# EAGLE design M688B (EAGLE 6.6.0)
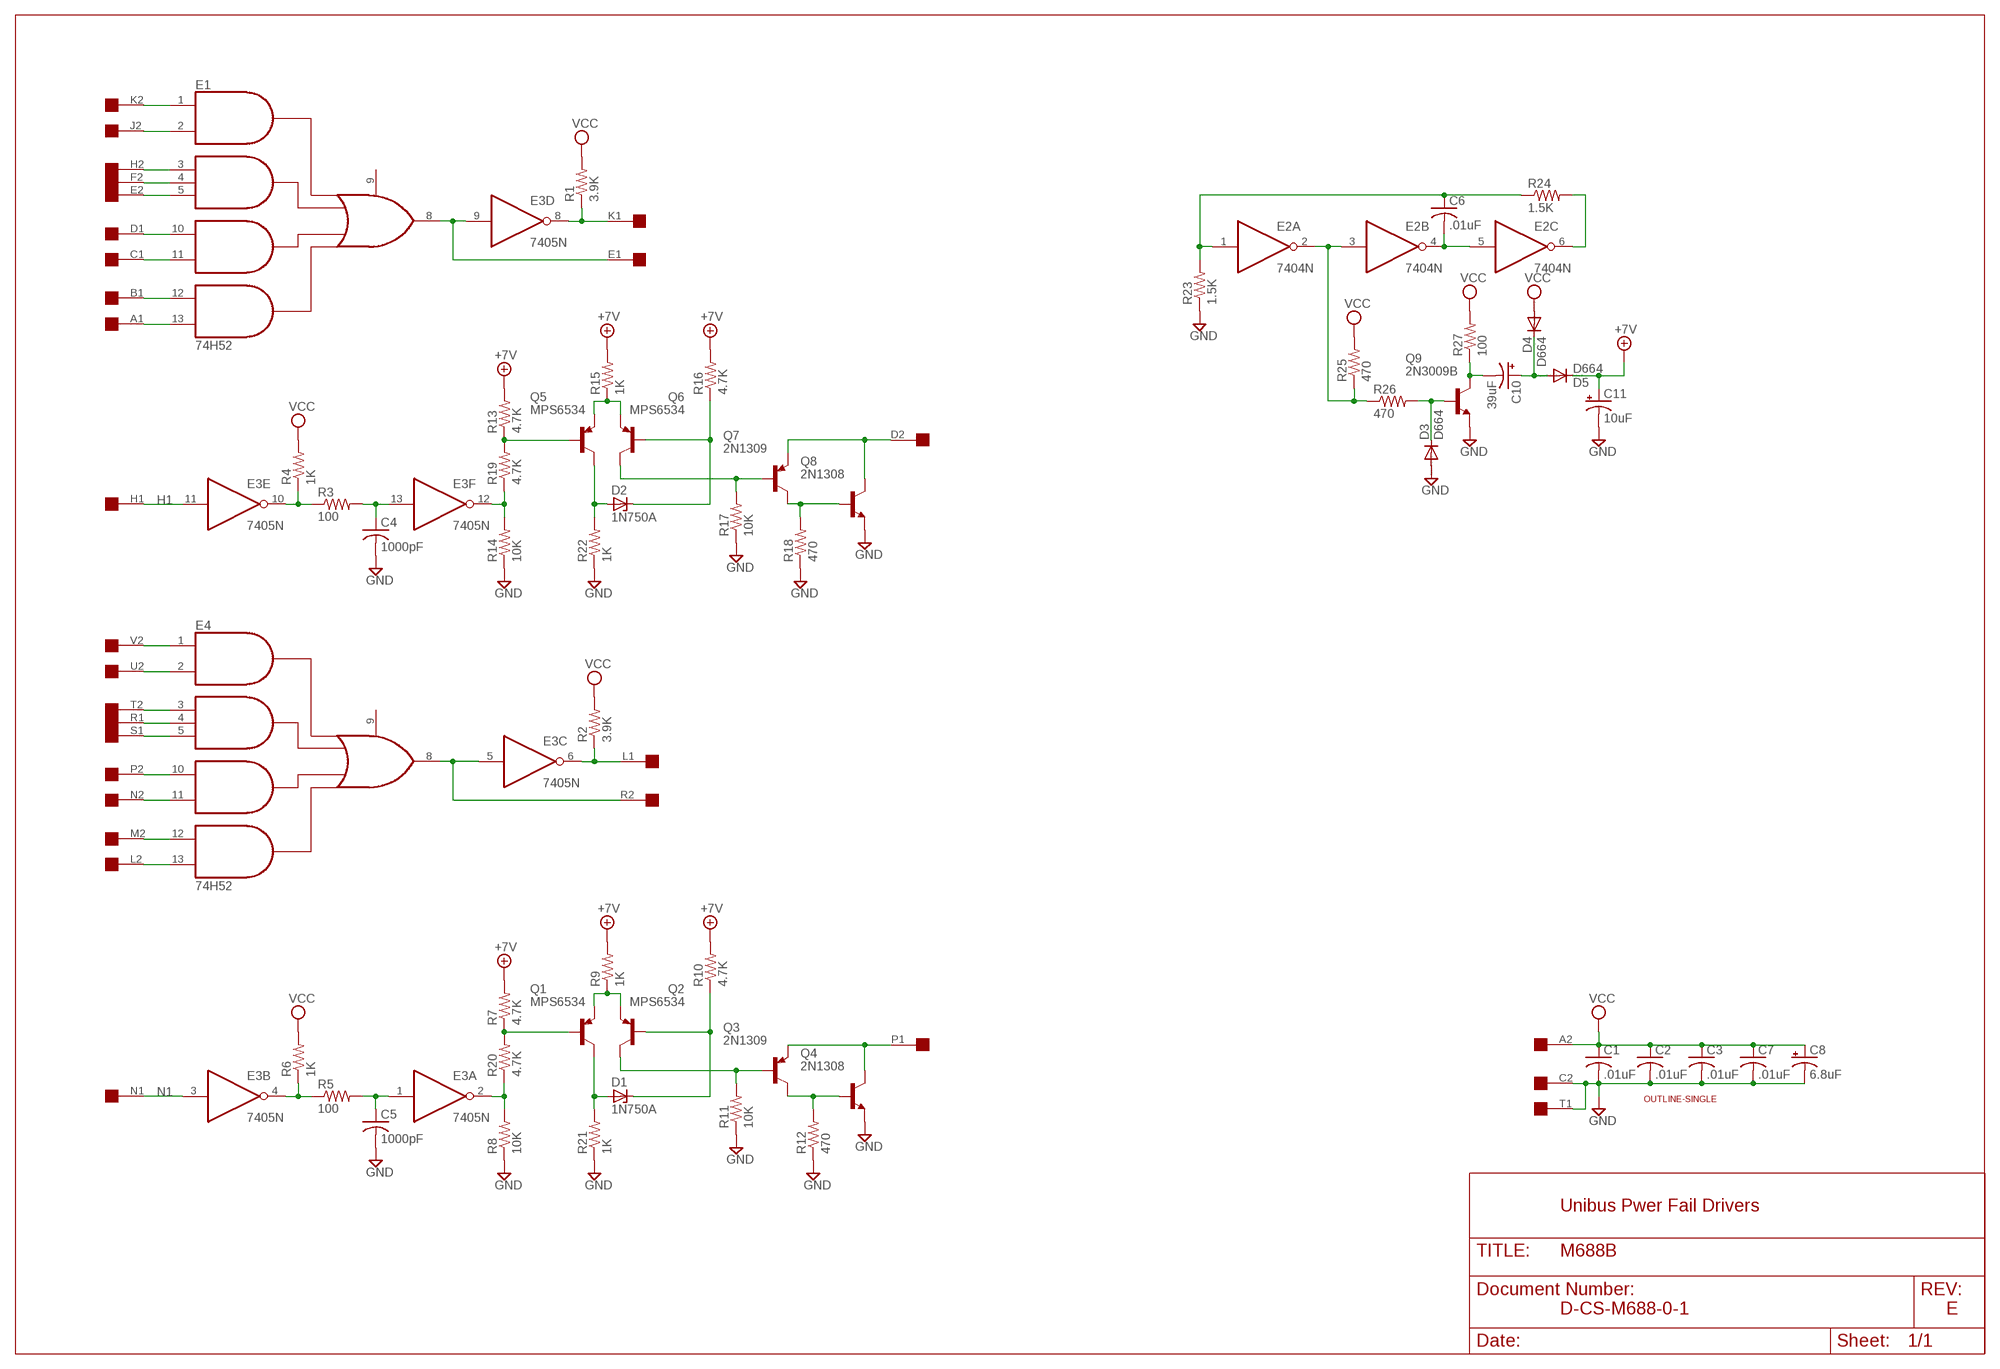
[diagram p0: schematic, sheet 1]

## Parts
C1  .01uF  C-US050-025X075  [C050-025X075]
C2  .01uF  C-US050-025X075  [C050-025X075]
C3  .01uF  C-US050-025X075  [C050-025X075]
C4  1000pF  C-US050-025X075  [C050-025X075]
C5  1000pF  C-US050-025X075  [C050-025X075]
C6  .01uF  C-US050-025X075  [C050-025X075]
C7  .01uF  C-US050-025X075  [C050-025X075]
C8  6.8uF  CPOL-USE20-8AXIAL  [E12-8]
C10  39uF  CPOL-USE20-8AXIAL  [E12-8]
C11  10uF  CPOL-USE20-8AXIAL  [E12-8]
D1  1N750A  ZENER-DIODEDO35Z10  [DO35Z10]
D2  1N750A  ZENER-DIODEDO35Z10  [DO35Z10]
D3  D664  DIODE-DO35-10  [DO35-10]
D4  D664  DIODE-DO35-10  [DO35-10]
D5  D664  DIODE-DO35-10  [DO35-10]
E1  74H52  [DIL14]
E2  7404N  [DIL14]
E3  7405N  [DIL14]
E4  74H52  [DIL14]
Q1  MPS6534  -PNP-TO5  [TO5]
Q2  MPS6534  -PNP-TO5  [TO5]
Q3  2N1309  -PNP-TO5  [TO5]
Q4  2N1308  -NPN-TO5  [TO5]
Q5  MPS6534  -PNP-TO5  [TO5]
Q6  MPS6534  -PNP-TO5  [TO5]
Q7  2N1309  -PNP-TO5  [TO5]
Q8  2N1308  -NPN-TO5  [TO5]
Q9  2N3009B  -NPN-TO5  [TO5]
R1  3.9K  R-US_0207/10  [0207/10]
R2  3.9K  R-US_0207/10  [0207/10]
R3  100  R-US_0207/10  [0207/10]
R4  1K  R-US_0207/10  [0207/10]
R5  100  R-US_0207/10  [0207/10]
R6  1K  R-US_0207/10  [0207/10]
R7  4.7K  R-US_0207/10  [0207/10]
R8  10K  R-US_0207/10  [0207/10]
R9  1K  R-US_0207/10  [0207/10]
R10  4.7K  R-US_0207/10  [0207/10]
R11  10K  R-US_0207/10  [0207/10]
R12  470  R-US_0207/10  [0207/10]
R13  4.7K  R-US_0207/10  [0207/10]
R14  10K  R-US_0207/10  [0207/10]
R15  1K  R-US_0207/10  [0207/10]
R16  4.7K  R-US_0207/10  [0207/10]
R17  10K  R-US_0207/10  [0207/10]
R18  470  R-US_0207/10  [0207/10]
R19  4.7K  R-US_0207/10  [0207/10]
R20  4.7K  R-US_0207/10  [0207/10]
R21  1K  R-US_0207/10  [0207/10]
R22  1K  R-US_0207/10  [0207/10]
R23  1.5K  R-US_0207/10  [0207/10]
R24  1.5K  R-US_0207/10  [0207/10]
R25  470  R-US_0207/10  [0207/10]
R26  470  R-US_0207/10  [0207/10]
R27  100  R-US_0207/10  [0207/10]
U$1  OUTLINE-SINGLE  [SINGLE]
U$2  SINGLE  [EDGE-CON2]

## Nets
+7V [supply]: C11.+ D5.C R7.2 R9.2 R10.2 R13.2 R15.2 R16.2
B1: E1.12(I12) U$2.B1
C1: E1.11(I11) U$2.C1
D1: E1.10(I10) U$2.D1
D2: Q7.1(E) Q8.3(C) U$2.D2
E1: E1.8(O8) E3.9(D:I) U$2.E1
E2: E1.5(I5) U$2.E2
F2: E1.4(I4) U$2.F2
GND [supply]: C1.2 C2.2 C3.2 C4.2 C5.2 C7.2 C8.- C11.- D3.A Q4.1(E) Q8.1(E) Q9.1(E) R8.1 R11.1 R12.1 R14.1 R17.1 R18.1 R21.1 R22.1 R23.1 U$2.C2 U$2.T1
H1: E3.11(E:I) U$2.H1
H2: E1.3(I3) U$2.H2
J2: E1.2(I2) U$2.J2
K1: E3.8(D:O) R1.1 U$2.K1
K2: E1.1(I1) U$2.K2
L1: E3.6(C:O) R2.1 U$2.L1
L2: E4.12(I12) U$2.M2
M2: E4.13(I13) U$2.L2
N1: E3.3(B:I) U$2.N1
N2: E4.11(I11) U$2.N2
N$1: E1.13(I13) U$2.A1
N$2: E3.10(E:O) R3.1 R4.1
N$3: C4.1 E3.13(F:I) R3.2
N$4: Q5.2(B) R13.1 R19.2
N$5: E3.12(F:O) R14.2 R19.1
N$6: Q5.1(E) Q6.1(E) R15.1
N$7: D2.A Q5.3(C) R22.2
N$8: D2.C Q6.2(B) R16.1
N$9: Q6.3(C) Q7.2(B) R17.2
N$10: Q7.3(C) Q8.2(B) R18.2
N$11: E3.4(B:O) R5.1 R6.1
N$12: C5.1 E3.1(A:I) R5.2
N$13: Q1.2(B) R7.1 R20.2
N$14: E3.2(A:O) R8.2 R20.1
N$15: Q1.1(E) Q2.1(E) R9.1
N$16: D1.A Q1.3(C) R21.2
N$17: D1.C Q2.2(B) R10.1
N$18: Q2.3(C) Q3.2(B) R11.2
N$19: Q3.3(C) Q4.2(B) R12.2
N$20: E2.2(A:O) E2.3(B:I) R25.1 R26.1
N$21: C6.2 E2.4(B:O) E2.5(C:I)
N$22: C6.1 E2.1(A:I) R23.2 R24.1
N$23: E2.6(C:O) R24.2
N$26: D3.C Q9.2(B) R26.2
N$27: C10.- Q9.3(C) R27.1
N$28: C10.+ D4.C D5.A
P1: Q3.1(E) Q4.3(C) U$2.P1
P2: E4.10(I10) U$2.P2
R1: E4.4(I4) U$2.R1
R2: E3.5(C:I) E4.8(O8) U$2.R2
S1: E4.5(I5) U$2.S1
T2: E4.3(I3) U$2.T2
U2: E4.2(I2) U$2.U2
V2: E4.1(I1) U$2.V2
VCC [supply]: C1.1 C2.1 C3.1 C7.1 C8.+ D4.A R1.2 R2.2 R4.2 R6.2 R25.2 R27.2 U$2.A2
Unconnected: E1.6(NC) E1.9(I9) E2.8(D:O) E2.9(D:I) E2.10(E:O) E2.11(E:I) E2.12(F:O) E2.13(F:I) E4.6(NC) E4.9(I9) U$2.B2 U$2.F1 U$2.J1 U$2.M1 U$2.S2 U$2.U1 U$2.V1

## Notes on the sheet
- Unibus Pwer Fail Drivers
- D-CS-M688-0-1 | E

## Power pins joined to a net without a drawn wire
GND: E1.7(GND) E2.7(P:GND) E3.7(P:GND) E4.7(GND)
VCC: E1.14(VCC) E2.14(P:VCC) E3.14(P:VCC) E4.14(VCC)

## Library data of the parts
C1-C7 = rcl:C-US: CAPACITOR, American symbol
C8 C10 C11 = dec-con:CPOL-USE20-8AXIAL: A 0.8 inch electrolytic.
D1 D2 = diode:ZENER-DIODE: Z-Diode
D3-D5 = diode:DIODE-: DIODE
E1 E4 = dec-con:74*52: Expandable 2-2-2-3 Input AND-OR gate.
E2 = 74xx-us:74*04: Hex INVERTER
E3 = 74xx-us:74*05: Hex INVERTER, open collector
Q1-Q3 Q5-Q7 = transistor:*-PNP-: PNP Transistror
Q4 Q8 Q9 = transistor:*-NPN-: NPN Transistror BF959 corrected 2008.03.06
R1-R27 = rcl:R-US_: RESISTOR, American symbol
U$1 = dec-con:OUTLINE-*: Board outlines for DEC boards.
U$2 = dec-con:SINGLE: Single-Height DEC board

## Net classes
1 supply: width 0.813 mm

## Board
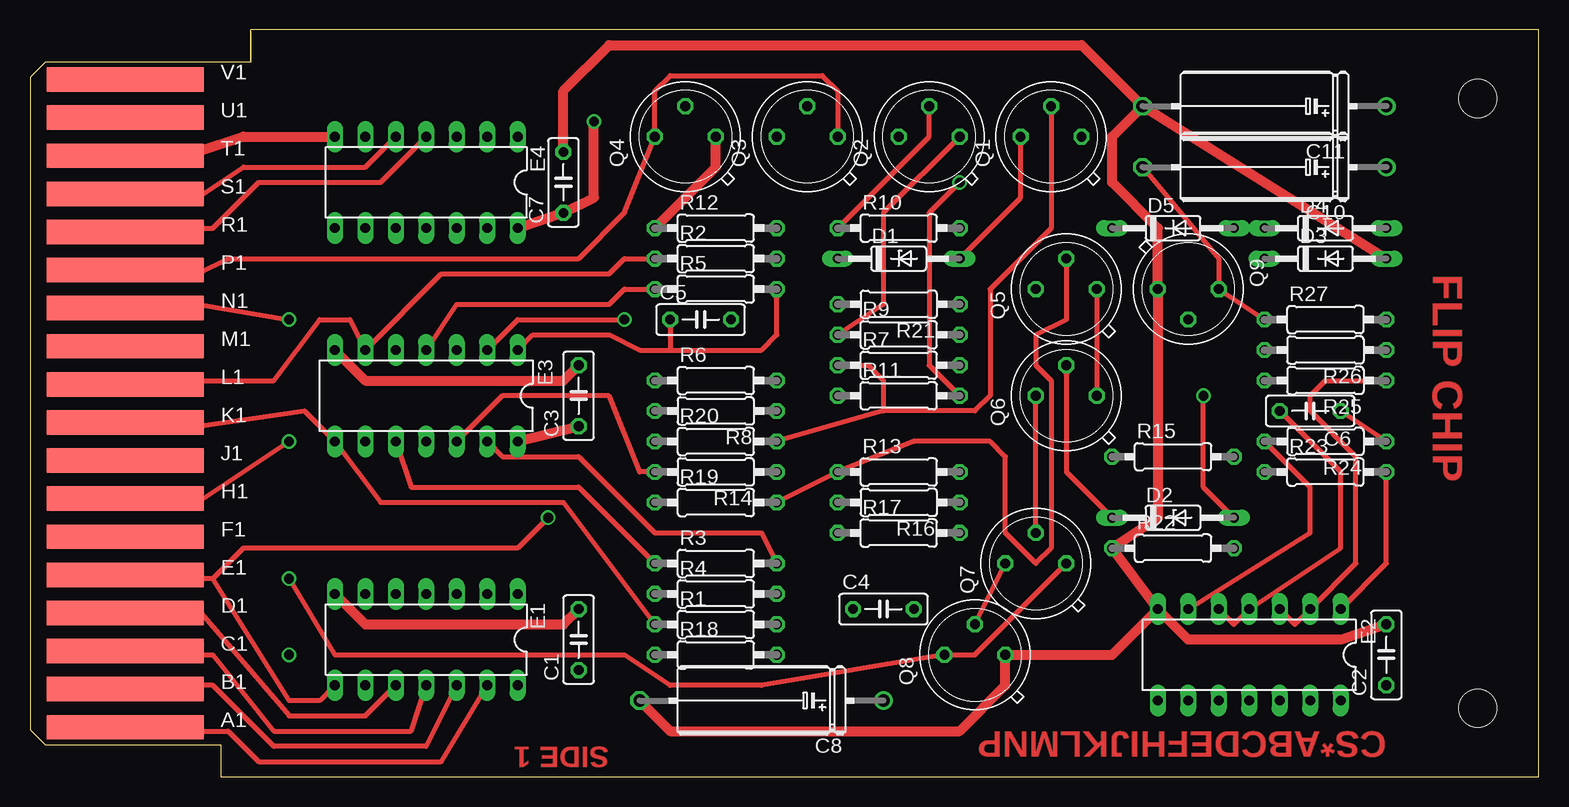
[diagram p1: board, top side]
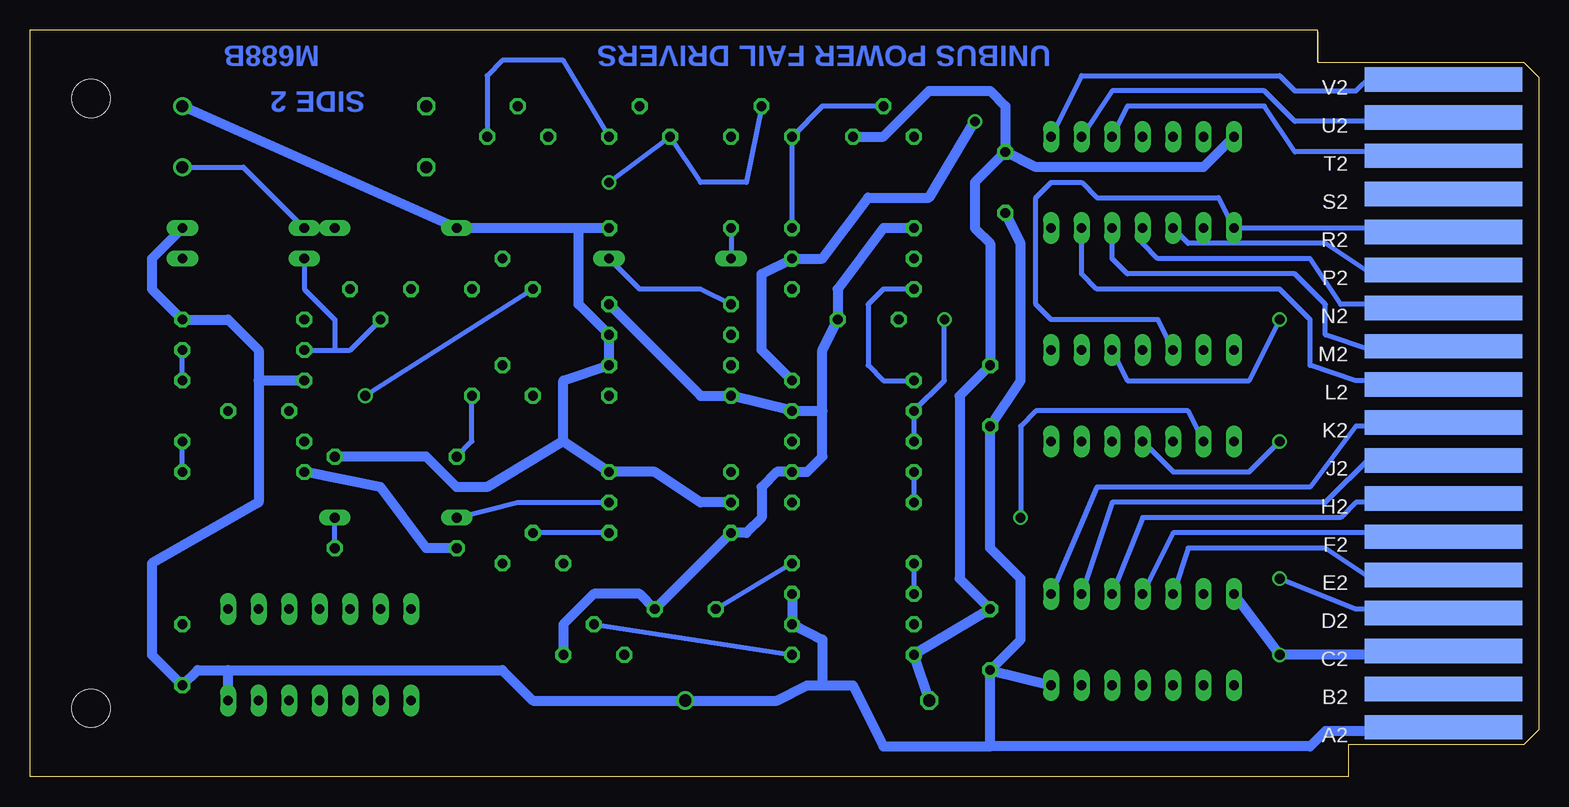
[diagram p2: board, bottom side, seen from below]

Size 125.73 x 62.23 mm. Coordinates in mm from the lower left corner, seen from the top.
Copper layers (1+16): Top 0.035mm / dielectric 1.5mm / Bottom 0.035mm
Design rules "16mils": minimum track width 16mil, minimum drill 32mil, track to track 15mil, track to pad 10mil, pad to pad 10mil, via to via 10mil, smd to smd 10mil, copper to edge 13mil, drill to drill 10mil, minimum pad ring 10mil, minimum via ring 8mil, stop-mask expansion 0mil, vias tented up to drill 0mil, thermal gap 10mil

### Footprints (pad centres in the part's own frame; a part is rotated, then mirrored left to right if it is on the bottom)
C050-025X075 = drill 0.813 octagon: 1 -2.54,0; 2 2.54,0
E12-8 = drill 1.016: + -10.16,0 | drill 1.016 octagon: - 10.16,0
DO35Z10 = drill 0.813 long: A 5.08,0; C -5.08,0
DO35-10 = drill 0.813 long: A 5.08,0; C -5.08,0
DIL14 = drill 0.813 long: 1 -7.62,-3.81; 2 -5.08,-3.81; 3 -2.54,-3.81; 4 0,-3.81; 5 2.54,-3.81; 6 5.08,-3.81; 7 7.62,-3.81; 8 7.62,3.81; 9 5.08,3.81; 10 2.54,3.81; 11 0,3.81; 12 -2.54,3.81; 13 -5.08,3.81; 14 -7.62,3.81
TO5 = drill 0.813 octagon: 1 0,-2.54; 2 2.54,0; 3 0,2.54
0207/10 = drill 0.813 octagon: 1 -5.08,0; 2 5.08,0
SINGLE = hole 3.175: 120.65,56.515; 120.65,5.715
EDGE-CON2 = smd 13.106 x 2.032: A1 7.938,4.128; B1 7.938,7.303; C1 7.938,10.477; D1 7.938,13.652; E1 7.938,16.828; F1 7.938,20.003; H1 7.938,23.177; J1 7.938,26.352; K1 7.938,29.527; L1 7.938,32.703; M1 7.938,35.877; N1 7.938,39.053; P1 7.938,42.227; R1 7.938,45.403; S1 7.938,48.578; T1 7.938,51.752; U1 7.938,54.928; V1 7.938,58.102 | smd 13.106 x 2.032 bottom: A2 7.938,4.128; B2 7.938,7.303; C2 7.938,10.477; D2 7.938,13.652; E2 7.938,16.828; F2 7.938,20.003; H2 7.938,23.177; J2 7.938,26.352; K2 7.938,29.527; L2 7.938,32.703; M2 7.938,35.877; N2 7.938,39.053; P2 7.938,42.227; R2 7.938,45.403; S2 7.938,48.578; T2 7.938,51.752; U2 7.938,54.928; V2 7.938,58.102

### Placement (x,y rotation side)
C1  45.72,11.43 90 top
C2  113.03,10.16 90 top
C3  45.72,31.75 90 top
C4  71.12,13.97 0 top
C5  55.88,38.1 0 top
C6  106.68,30.48 180 top
C7  44.45,49.53 90 top
C8  60.96,6.35 180 top
C10  102.87,50.8 180 top
C11  102.87,55.88 180 top
D1  72.39,43.18 0 top
D2  95.25,21.59 0 top
D3  107.95,43.18 0 top
D4  107.95,45.72 0 top
D5  95.25,45.72 0 top
E1  33.02,11.43 180 top
E2  101.6,10.16 180 top
E3  33.02,31.75 180 top
E4  33.02,49.53 180 top
Q1  85.09,53.34 90 top
Q2  74.93,53.34 90 top
Q3  64.77,53.34 90 top
Q4  54.61,53.34 90 top
Q5  86.36,40.64 90 top
Q6  86.36,31.75 90 top
Q7  83.82,17.78 90 top
Q8  78.74,10.16 90 top
Q9  96.52,40.64 270 top
R1  57.15,12.7 0 top
R2  57.15,43.18 0 top
R3  57.15,17.78 0 top
R4  57.15,15.24 0 top
R5  57.15,40.64 0 top
R6  57.15,33.02 0 top
R7  72.39,34.29 0 top
R8  57.15,30.48 180 top
R9  72.39,36.83 0 top
R10  72.39,45.72 0 top
R11  72.39,31.75 0 top
R12  57.15,45.72 0 top
R13  72.39,25.4 0 top
R14  57.15,25.4 180 top
R15  95.25,26.67 0 top
R16  72.39,22.86 180 top
R17  72.39,20.32 0 top
R18  57.15,10.16 0 top
R19  57.15,22.86 0 top
R20  57.15,27.94 0 top
R21  72.39,39.37 180 top
R22  95.25,19.05 0 top
R23  107.95,25.4 0 top
R24  107.95,27.94 180 top
R25  107.95,33.02 180 top
R26  107.95,35.56 180 top
R27  107.95,38.1 0 top
U$1  0,0 0 top
U$2  0,0 0 top

### Tracks (layer width: path | path; a pad name or v marks a point on that pad's centre or on a via)
+7V
  Bottom 0.813: C11.+ D5.C 80.01,45.72 | R16.2 69.85,22.86 73.66,25.4 R13.2 81.28,27.94 | 81.28,27.94 87.63,24.13 90.17,24.13 92.71,26.67 R15.2 | R10.2 80.01,45.72 | 81.28,27.94 81.28,33.02 R7.2 R9.2 80.01,39.37 80.01,45.72
B1
  Top 0.406: E1.12 33.02,2.54 20.32,2.54 15.24,7.62 8.89,7.62 U$2.B1
C1
  Top 0.406: U$2.C1 8.89,10.16 15.24,10.16 20.32,3.81 31.75,3.81 E1.11
D1
  Top 0.406: U$2.D1 8.89,13.97 13.97,13.97 21.59,5.08 27.94,5.08 E1.10
D2  (via drill 0.81)
  Top 0.406: v21.59,16.51 25.4,10.16 49.53,10.16 53.34,7.62 60.96,7.62 Q8.3 78.74,10.16 Q7.1
  Bottom 0.406: U$2.D2 8.89,13.97 15.24,13.97 v21.59,16.51
E1  (via drill 0.81)
  Top 0.406: E1.8 24.13,6.35 21.59,6.35 15.24,16.51 | 15.24,16.51 8.89,16.51 U$2.E1 | v43.18,21.59 40.64,19.05 17.78,19.05 15.24,16.51
  Bottom 0.406: E3.9 29.21,30.48 41.91,30.48 43.18,29.21 v43.18,21.59
E2
  Bottom 0.406: U$2.E2 10.16,16.83 10.16,16.51 13.97,16.51 17.78,19.05 29.21,19.05 E1.5
F2
  Bottom 0.406: U$2.F2 10.16,20.32 30.48,20.32 E1.4
GND  (via drill 0.81)
  Top 0.813: E2.7 R22.1 93.98,21.59 Q9.1 93.98,45.72 90.17,49.53 90.17,53.34 C11.- | R12.1 57.15,50.8 Q4.1 | E1.7 27.94,12.7 44.45,12.7 C1.2 | E3.7 27.94,33.02 44.45,33.02 C3.2 | C7.2 44.45,57.15 48.26,60.96 87.63,60.96 C11.- | U$2.T1 8.89,52.07 13.97,52.07 17.78,53.34 E4.7 | C8.- 53.34,3.81 77.47,3.81 81.28,7.62 Q8.1 90.17,10.16 E2.7 | C11.- D3.A | C2.2 109.22,11.43 96.52,11.43 E2.7
  Bottom 0.813: U$2.C2 10.16,10.16 v21.59,10.16 E1.7 | C7.2 46.99,49.53 46.99,45.72 45.72,44.45 C3.2 48.26,31.75 48.26,16.51 C1.2 R18.1 C8.- | R22.1 92.71,19.05 96.52,24.13 R23.1 | R21.1 69.85,31.75 R11.1 R8.1 59.69,30.48 | E4.7 27.94,50.8 41.91,50.8 C7.2 | Q8.1 81.28,12.7 78.74,15.24 74.93,15.24 C4.2 R17.1 66.04,20.32 64.77,21.59 64.77,24.13 63.5,25.4 R14.1 60.96,25.4 59.69,26.67 59.69,30.48 | 59.69,30.48 59.69,35.56 C5.2 58.42,40.64 54.61,45.72 R12.1 | Q4.1 54.61,53.34 50.8,57.15 45.72,57.15 44.45,55.88 C7.2
H1  (via drill 0.81)
  Top 0.406: U$2.H1 10.16,22.86 13.97,22.86 v21.59,27.94
  Bottom 0.406: E3.11 30.48,25.4 24.13,25.4 v21.59,27.94
H2
  Bottom 0.406: U$2.H2 10.16,22.86 15.24,22.86 16.51,21.59 33.02,21.59 E1.3
J2
  Bottom 0.406: U$2.J2 8.89,26.67 13.97,26.67 17.78,22.86 35.56,22.86 E1.2
K1
  Top 0.406: U$2.K1 10.16,29.21 13.97,29.21 22.86,30.48 E3.8 29.21,22.86 44.45,22.86 R1.1
K2
  Bottom 0.406: U$2.K2 10.16,29.21 15.24,29.21 19.05,24.13 36.83,24.13 E1.1
L1
  Top 0.406: U$2.L1 8.89,33.02 20.32,33.02 24.13,38.1 26.67,38.1 E3.6 34.29,41.91 48.26,41.91 49.53,43.18 R2.1
L2
  Bottom 0.406: U$2.M2 10.16,35.56 13.97,35.56 17.78,36.83 17.78,39.37 20.32,41.91 34.29,41.91 35.56,43.18 E4.12
M2
  Bottom 0.406: U$2.L2 8.89,33.02 15.24,33.02 19.05,34.29 19.05,38.1 21.59,40.64 36.83,40.64 38.1,41.91 E4.13
N1  (via drill 0.81)
  Top 0.406: U$2.N1 8.89,39.37 13.97,39.37 v21.59,38.1
  Bottom 0.406: E3.3 34.29,33.02 24.13,33.02 v21.59,38.1
N2
  Bottom 0.406: U$2.N2 8.89,39.37 16.51,39.37 19.05,43.18 31.75,43.18 33.02,44.45 E4.11
N$1
  Top 0.406: U$2.A1 8.89,3.81 16.51,3.81 19.05,1.27 34.29,1.27 E1.13
N$2
  Top 0.406: E3.10 31.75,24.13 45.72,24.13 R3.1
  Bottom 0.406: R3.1 R4.1
N$3
  Top 0.406: E3.13 39.37,26.67 45.72,26.67 52.07,20.32 60.96,20.32 R3.2
  Bottom 0.406: R3.2 C4.1
N$4
  Top 0.406: R19.2 R13.1 73.66,27.94 80.01,27.94 81.28,26.67 81.28,20.32 83.82,17.78 85.09,19.05 85.09,33.02 83.82,34.29 83.82,36.83 86.36,38.1 Q5.2
N$5
  Top 0.406: R14.2 50.8,25.4 48.26,31.75 39.37,31.75 E3.12
  Bottom 0.406: R14.2 R19.1
N$6
  Top 0.406: Q5.1 Q6.1
  Bottom 0.406: R15.1 88.9,27.94 Q6.1
N$7  (via drill 0.81)
  Top 0.406: D2.A 97.79,24.13 v97.79,31.75
  Bottom 0.406: R22.2 D2.A | Q5.3 v97.79,31.75
N$8
  Top 0.406: Q6.2 86.36,25.4 D2.C
  Bottom 0.406: D2.C 85.09,22.86 R16.1
N$9
  Top 0.406: Q7.2 Q6.3
  Bottom 0.406: R17.2 Q7.2
N$10
  Top 0.406: Q8.2 Q7.3
  Bottom 0.406: Q8.2 R18.2
N$11
  Top 0.406: E3.4 35.56,39.37 48.26,39.37 49.53,40.64 R5.1
  Bottom 0.406: R5.1 54.61,40.64 55.88,39.37 55.88,34.29 54.61,33.02 R6.1
N$12
  Top 0.406: E3.1 41.91,36.83 48.26,36.83 50.8,35.56 53.34,35.56 | 53.34,35.56 60.96,35.56 62.23,36.83 R5.2 | C5.1 53.34,35.56
N$13
  Top 0.406: Q1.2 85.09,45.72 80.01,40.64 80.01,31.75 78.74,30.48 71.12,30.48 | 71.12,30.48 R20.2 | R7.1 69.85,34.29 71.12,33.02 71.12,30.48
N$14  (via drill 0.81)
  Top 0.406: E3.2 40.64,38.1 v49.53,38.1
  Bottom 0.406: R20.1 R8.2 49.53,33.02 v49.53,38.1
N$15
  Top 0.406: Q2.1 71.12,46.99 71.12,39.37 R9.1
  Bottom 0.406: Q2.1 81.28,59.69 86.36,59.69 87.63,58.42 Q1.1
N$16
  Top 0.406: D1.A 82.55,48.26 Q1.3
  Bottom 0.406: R21.2 69.85,40.64 74.93,40.64 D1.A
N$17
  Top 0.406: R10.1 74.93,53.34 Q2.2
  Bottom 0.406: R10.1 D1.C
N$18  (via drill 0.81)
  Top 0.406: v77.47,49.53 74.93,46.99 74.93,34.29 R11.2
  Bottom 0.406: Q3.2 66.04,49.53 69.85,49.53 Q2.3 v77.47,49.53
N$19
  Bottom 0.406: R12.2 Q3.3 59.69,55.88 Q4.2
N$20
  Top 0.406: E2.3 105.41,12.7 E2.2 110.49,17.78 110.49,26.67 106.68,30.48 106.68,31.75 107.95,33.02 R25.1
  Bottom 0.406: R25.1 R26.1
N$21
  Top 0.406: E2.5 100.33,12.7 E2.4 109.22,19.05 109.22,25.4 C6.2
N$22
  Top 0.406: E2.1 113.03,17.78 R23.2 | C6.1 R24.1
  Bottom 0.406: R23.2 R24.1
N$23
  Top 0.406: E2.6 106.68,20.32 106.68,24.13 R24.2
N$26
  Bottom 0.406: R26.2 100.33,35.56 | 100.33,35.56 99.06,35.56 Q9.2 | D3.C 102.87,40.64 100.33,38.1 100.33,35.56
N$27
  Top 0.406: C10.- 99.06,43.18 Q9.3 R27.1
N$28
  Bottom 0.406: C10.+ 107.95,50.8 D4.C D5.A
P1
  Top 0.406: U$2.P1 8.89,41.91 13.97,41.91 16.51,43.18 45.72,43.18 49.53,46.99 Q4.3 52.07,57.15 53.34,58.42 66.04,58.42 67.31,57.15 Q3.1
P2
  Bottom 0.406: U$2.P2 10.16,41.91 13.97,41.91 17.78,44.45 29.21,44.45 E4.10
R1
  Top 0.406: U$2.R1 8.89,45.72 15.24,45.72 19.05,49.53 29.21,49.53 E4.4
R2
  Bottom 0.406: E3.5 31.75,38.1 40.64,38.1 41.91,39.37 41.91,48.26 40.64,49.53 38.1,49.53 36.83,48.26 26.67,48.26 E4.8 10.16,45.72 U$2.R2
S1
  Top 0.406: U$2.S1 8.89,48.26 13.97,48.26 17.78,50.8 27.94,50.8 E4.5
T2
  Bottom 0.406: U$2.T2 8.89,52.07 20.32,52.07 22.86,55.88 34.29,55.88 E4.3
U2
  Bottom 0.406: U$2.U2 8.89,54.61 20.32,54.61 22.86,57.15 35.56,57.15 E4.2
V2
  Bottom 0.406: E4.1 38.1,58.42 21.59,58.42 20.32,57.15 15.24,57.15 13.97,58.42 8.89,58.42 U$2.V2
VCC  (via drill 0.81)
  Top 0.813: E3.14 C3.1 | E4.14 C7.1 46.99,48.26 v46.99,54.61
  Bottom 0.813: U$2.A2 8.89,3.81 17.78,3.81 19.05,2.54 45.72,2.54 | 45.72,2.54 C1.1 | C1.1 E1.14 | 59.69,7.62 60.96,7.62 63.5,6.35 C8.+ 83.82,6.35 86.36,8.89 109.22,8.89 | 59.69,7.62 57.15,7.62 54.61,2.54 45.72,2.54 | 109.22,8.89 111.76,8.89 C2.1 115.57,10.16 115.57,17.78 106.68,22.86 106.68,33.02 | E2.14 109.22,8.89 | C1.1 43.18,11.43 43.18,16.51 45.72,19.05 C3.1 43.18,33.02 43.18,44.45 C7.1 | 59.69,7.62 59.69,11.43 R1.2 R4.2 | D4.A 115.57,43.18 115.57,40.64 R27.2 109.22,38.1 106.68,35.56 106.68,33.02 | R25.2 106.68,33.02 | R6.2 64.77,35.56 64.77,41.91 R2.2 59.69,43.18 55.88,48.26 50.8,48.26 v46.99,54.61

### Text on the board
Top: FLIP CHIP | CS*ABCDEFHIJKLMNP | SIDE 1
Bottom: UNIBUS POWER FAIL DRIVERS | M688B | SIDE 2